# Altium schematic sheet Sheet1.SchDoc
size A3
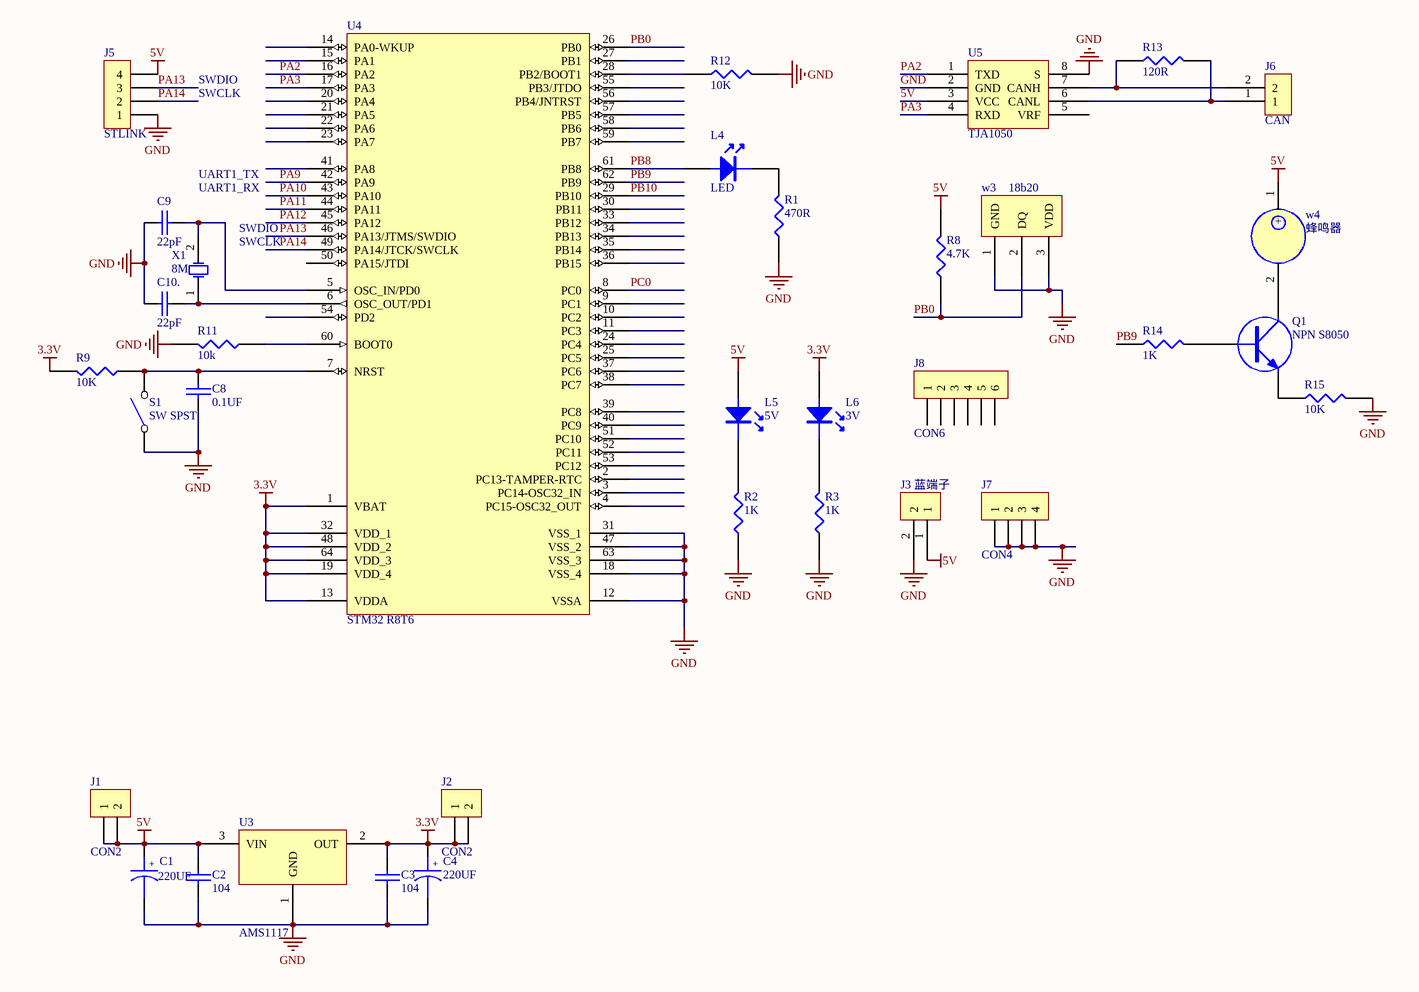
[diagram p0: Sheet1.SchDoc]

## Parts
C1  220UF  [RB1-2]
C2  104  [1206]
C3  104  [1206]
C4  220UF  [RB1-2]
C8  0.1UF  [1206]
C9  22pF  [1206]
C10.  22pF  [1206]
J1  CON2  [SIP2]
J2  CON2  [SIP2]
J3  蓝端子  [蓝端子]
J5  STLINK  [SIP4]
J6  CAN  [蓝端子]
J7  CON4  [SIP4]
J8  CON6  [SIP6]
L4  LED  [0805]
L5  5V  [0805]
L6  3V  [0805]
Q1  NPN S8050
R1  470R  [AXIAL0.4]
R2  1K  [AXIAL0.4]
R3  1K  [AXIAL0.4]
R8  4.7K  [AXIAL0.4]
R9  10K  [AXIAL0.4]
R11  10k  [AXIAL0.4]
R12  10K  [AXIAL0.4]
R13  120R  [AXIAL0.4]
R14  1K  [AXIAL0.4]
R15  10K  [AXIAL0.4]
S1  SW SPST
U3  AMS1117  [AMS117]
U4  STM32 R8T6  [STM32   64]
U5  TJA1050
w3  18b20
w4  蜂鸣器
X1  8M  [SMD49S]

## Nets
3.3V: C3.1 C4.1 J2.1 J2.2 L6.2 R9.2 U3.2(OUT) U4.1(VBAT) U4.13(VDDA) U4.19(VDD_4) U4.32(VDD_1) U4.48(VDD_2) U4.64(VDD_3)
5V: C1.1 C2.1 J1.1 J1.2 J3.1 J5.4 L5.2 R8.2 U3.3(VIN) U5.3(VCC) w4.1(+)
GND: C1.2 C2.2 C3.2 C4.2 C8.2 C9.1 C10..1 J3.2 J5.1 J7.1 J7.2 J7.3 J7.4 R1.1 R2.1 R3.1 R11.2 R12.2 R15.2 S1.1(COMMON) U3.1(GND) U4.12(VSSA) U4.18(VSS_4) U4.31(VSS_1) U4.47(VSS_2) U4.63(VSS_3) U5.2(GND) U5.8(S) w3.1(GND) w3.3(VDD)
PA2: U4.16(PA2) U5.1(TXD)
PA3: U4.17(PA3) U5.4(RXD)
PA9: U4.42(PA9)
PA10: U4.43(PA10)
PA11: U4.44(PA11)
PA12: U4.45(PA12)
PA13: J5.3 U4.46(PA13/JTMS/SWDIO)
PA14: J5.2 U4.49(PA14/JTCK/SWCLK)
PB0: R8.1 U4.26(PB0) w3.2(DQ)
PB8: L4.2 U4.61(PB8)
PB9: R14.1 U4.62(PB9)
PB10: U4.29(PB10)
PC0: U4.8(PC0)
NetC8_1: C8.1 R9.1 S1.2(NO) U4.7(NRST)
NetC9_2: C9.2 U4.5(OSC_IN/PD0) X1.2
NetC10._2: C10..2 U4.6(OSC_OUT/PD1) X1.1
NetJ6_1: J6.1 R13.2 U5.6(CANL)
NetJ6_2: J6.2 R13.1 U5.7(CANH)
NetL4_1: L4.1 R1.2
NetL5_1: L5.1 R2.2
NetL6_1: L6.1 R3.2
NetQ1_1: Q1.1(B) R14.2
NetQ1_2: Q1.2(C) w4.2
NetQ1_3: Q1.3(E) R15.1
NetR11_1: R11.1 U4.60(BOOT0)
NetR12_1: R12.1 U4.28(PB2/BOOT1)

Not connected (* = marked no-connect by the designer): J8 1 2 3 4 5 6; U4 2(PC13-TAMPER-RTC) 3(PC14-OSC32_IN) 4(PC15-OSC32_OUT) 9(PC1) 10(PC2) 11(PC3) 14(PA0-WKUP) 15(PA1) 20(PA4) 21(PA5) 22(PA6) 23(PA7) 24(PC4) 25(PC5) 27(PB1) 30(PB11) 33(PB12) 34(PB13) 35(PB14) 36(PB15) 37(PC6) 38(PC7) 39(PC8) 40(PC9) 41(PA8) 50(PA15/JTDI) 51(PC10) 52(PC11) 53(PC12) 54(PD2) 55(PB3/JTDO) 56(PB4/JNTRST) 57(PB5) 58(PB6) 59(PB7); U5 5(VRF)

## Notes on the sheet
- SWDIO
- SWCLK
- (near C9) UART1_TX
- (near C9) UART1_RX
- (near X1) SWCLK
- (in symbol 有极性电容) +

## Library data of the parts
C1 C4 = 有极性电容
C2 C3 C8 C9 C10. = 无极性电容
J5 = CON4
J6 = 蓝端子
L5 L6 = LED
Q1 = NPN: NPN 型三极管
R1-R3 R8 R9 R11-R15 = 电阻2
S1 = SW SPST: 单刀单掷开关
X1 = XTAL_SMD: Crystal Oscillator; ERP: 0103040021; Value: 8MHz; TOL: ±20ppm; Tolerate: ROSON -20_+70 20pf; PCB_Layout: Top Layer SMC; Publisher: ZL_A0OFFICE; Revision: 2012-3-28